# Altium project driver_irf_version.PrjPcb
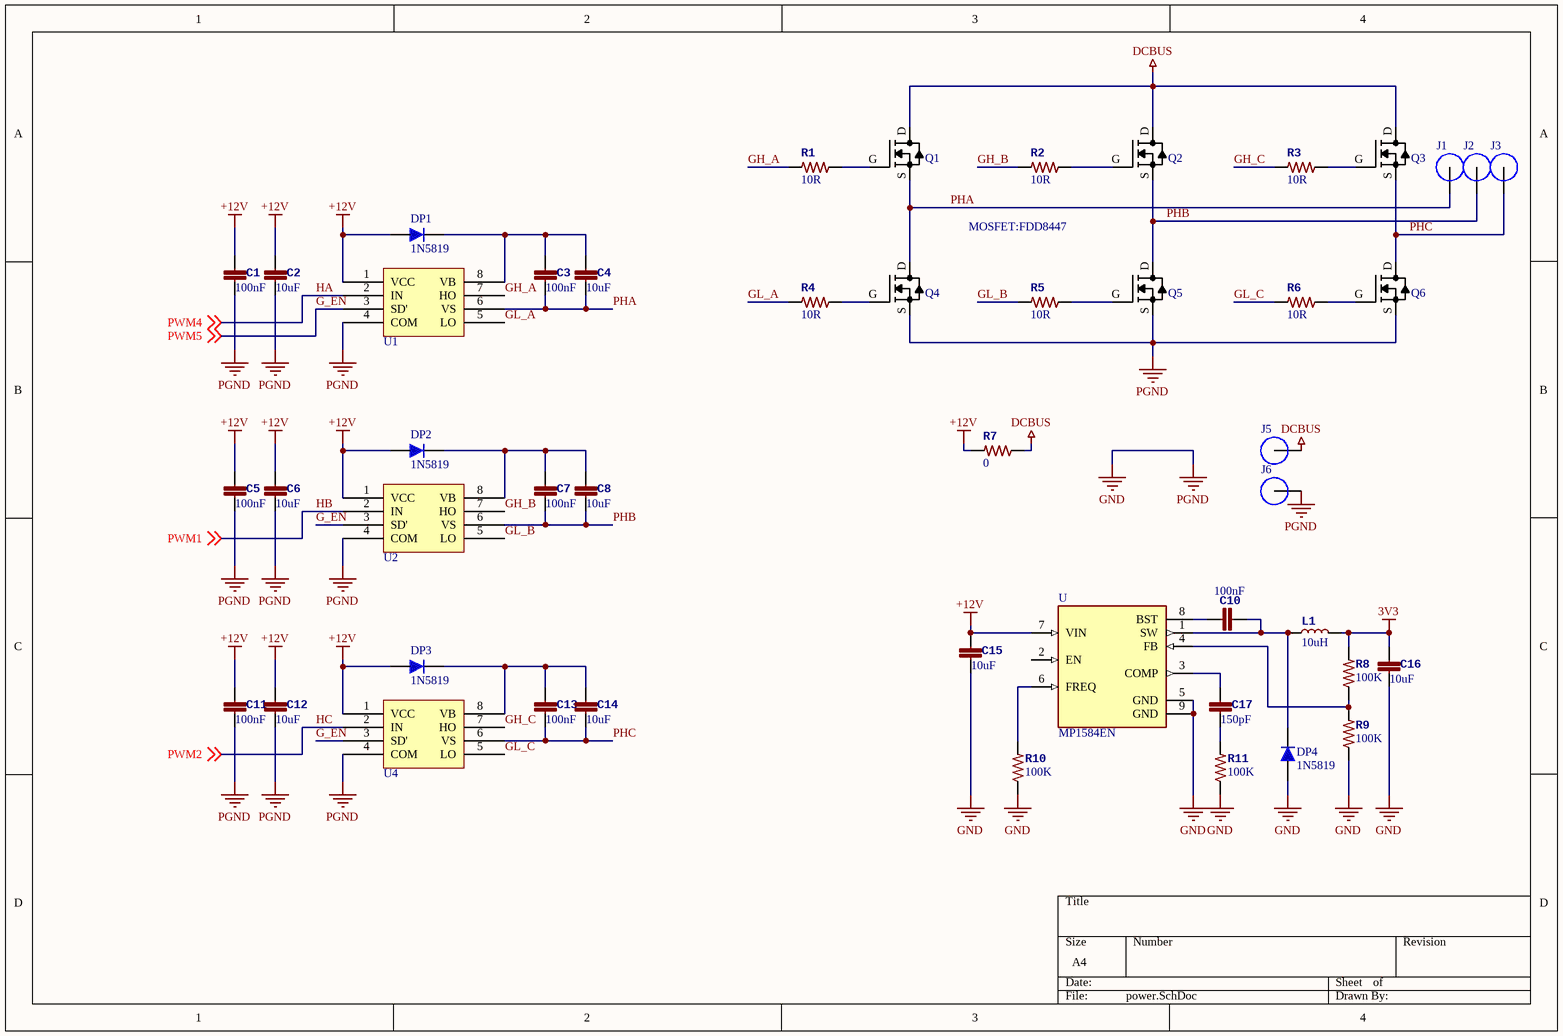
[diagram p0: power.SchDoc]
2 sheets, 67 parts. Net scope: global (net labels, ports and power ports of the same name join across sheets).
Board file: PCB.PcbDoc
Sheets:
  power.SchDoc
  mcu.SchDoc

## Sheet power.SchDoc
size A4

### Parts
C1  value 100nF  [_1206]  (hidden comment: Cap)
C2  value 10uF  [_1206]  (hidden comment: Cap)
C3  value 100nF  [_1206]  (hidden comment: Cap)
C4  value 10uF  [_1206]  (hidden comment: Cap)
C5  value 100nF  [_1206]  (hidden comment: Cap)
C6  value 10uF  [_1206]  (hidden comment: Cap)
C7  value 100nF  [_1206]  (hidden comment: Cap)
C8  value 10uF  [_1206]  (hidden comment: Cap)
C10  value 100nF  [_0805]  (hidden comment: Cap)
C11  value 100nF  [_1206]  (hidden comment: Cap)
C12  value 10uF  [_1206]  (hidden comment: Cap)
C13  value 100nF  [_1206]  (hidden comment: Cap)
C14  value 10uF  [_1206]  (hidden comment: Cap)
C15  value 10uF  [_1206]  (hidden comment: Cap)
C16  value 10uF  [_1206]  (hidden comment: Cap)
C17  value 150pF  [_0805]  (hidden comment: Cap)
DP1  1N5819  [430X270D]
DP2  1N5819  [430X270D]
DP3  1N5819  [430X270D]
DP4  1N5819  [430X270D]
J1  (no value)  [M3 Spade Hole]
J2  (no value)  [M3 Spade Hole]
J3  (no value)  [M3 Spade Hole]
J5  (no value)  [M3 Spade Hole]
J6  (no value)  [M3 Spade Hole]
L1  value 10uH  [_INDUCTOR-SMD-6.0mm]  (hidden comment: Inductor)
Q1  FILL_FOOTPRINT  [TO229P994X240-3N]  (value not drawn)
Q2  FILL_FOOTPRINT  [TO229P994X240-3N]  (value not drawn)
Q3  FILL_FOOTPRINT  [TO229P994X240-3N]  (value not drawn)
Q4  FILL_FOOTPRINT  [TO229P994X240-3N]  (value not drawn)
Q5  FILL_FOOTPRINT  [TO229P994X240-3N]  (value not drawn)
Q6  FILL_FOOTPRINT  [TO229P994X240-3N]  (value not drawn)
R1  value 10R  [_0805]  (hidden comment: Resistor)
R2  value 10R  [_0805]  (hidden comment: Resistor)
R3  value 10R  [_0805]  (hidden comment: Resistor)
R4  value 10R  [_0805]  (hidden comment: Resistor)
R5  value 10R  [_0805]  (hidden comment: Resistor)
R6  value 10R  [_0805]  (hidden comment: Resistor)
R7  value 0  [_1206]  (hidden comment: Resistor)
R8  value 100K  [_0805]  (hidden comment: Resistor)
R9  value 100K  [_0805]  (hidden comment: Resistor)
R10  value 100K  [_0805]  (hidden comment: Resistor)
R11  value 100K  [_0805]  (hidden comment: Resistor)
U  MP1584EN  [SOIC127P600X170-9N]
U1  IR2104  [_SO08]  (value not drawn)
U2  IR2104  [_SO08]  (value not drawn)
U4  IR2104  [_SO08]  (value not drawn)

### Nets
3V3: C16.1 L1.2 R8.2
+12V: C1.1 C2.1 C5.1 C6.1 C11.1 C12.1 C15.1 DP1.1 DP2.1 DP3.1 R7.2 U.7(VIN) U1.1(VCC) U2.1(VCC) U4.1(VCC)
DCBUS: J5.1 Q1.D Q2.D Q3.D R7.1
GND: C1.2 C2.2 C5.2 C6.2 C11.2 C12.2 C15.2 C16.2 DP4.1 J6.1 Q4.S Q5.S Q6.S R9.1 R10.1 R11.1 U.5(GND) U.9(GND) U1.4(COM) U2.4(COM) U4.4(COM)  [also labelled PGND]
G_EN: U1.3(SD') U2.3(SD') U4.3(SD') ; off-sheet PWM5  [also labelled PWM5]
GH_A: R1.2 U1.7(HO)
GH_B: R2.2 U2.7(HO)
GH_C: R3.2 U4.7(HO)
GL_A: R4.2 U1.5(LO)
GL_B: R5.2 U2.5(LO)
GL_C: R6.2 U4.5(LO)
HA: U1.2(IN) ; off-sheet PWM4  [also labelled PWM4]
HB: U2.2(IN) ; off-sheet PWM1  [also labelled PWM1]
HC: U4.2(IN) ; off-sheet PWM2  [also labelled PWM2]
PHA: C3.2 C4.2 J1.1 Q1.S Q4.D U1.6(VS)
PHB: C7.2 C8.2 J2.1 Q2.S Q5.D U2.6(VS)
PHC: C13.2 C14.2 J3.1 Q3.S Q6.D U4.6(VS)
NetC3_1: C3.1 C4.1 DP1.2 U1.8(VB)
NetC7_1: C7.1 C8.1 DP2.2 U2.8(VB)
NetC10_1: C10.1 U.8(BST)
NetC10_2: C10.2 DP4.2 L1.1 U.1(SW)
NetC13_1: C13.1 C14.1 DP3.2 U4.8(VB)
NetC17_1: C17.1 U.3(COMP)
NetC17_2: C17.2 R11.2
NetQ1_G: Q1.G R1.1
NetQ2_G: Q2.G R2.1
NetQ3_G: Q3.G R3.1
NetQ4_G: Q4.G R4.1
NetQ5_G: Q5.G R5.1
NetQ6_G: Q6.G R6.1
NetR8_1: R8.1 R9.2 U.4(FB)
NetR10_2: R10.2 U.6(FREQ)

Not connected (* = marked no-connect by the designer): U 2(EN)

### Notes on the sheet
- MOSFET:FDD8447

### Library data of the parts
C1-C8 C10-C17 = Cap_1
DP1-DP4 = 1N5819: Schottkey Rectifiers; Designer: Abbas Basereh; Data: 16-12-2016; Link: *; Part. No: *
J1-J3 J5 J6 = M3 Spade Terminal
Q1-Q6 = NTMFS4935NT1G: MOSFET N-CH 30V 13A SO8FL; Manufacturer: ON Semiconductor; FET Type: N-Channel; Current - Continuous Drain (Id) @ 25°C: 13A (Ta), 93A (Tc); Drive Voltage (Max Rds On,  Min Rds On): 4.5V, 10V; Vgs(th) (Max) @ Id: 2.2V @ 250µA; Gate Charge (Qg) (Max) @ Vgs: 49.4nC @ 10V; Input Capacitance (Ciss) (Max) @ Vds: 4850pF @ 15V; Vgs (Max): ±20V; Power Dissipation (Max): 930mW (Ta), 48W (Tc); Rds On (Max) @ Id, Vgs: 3.2 mOhm @ 30A, 10V; Supplier 1: Digi-Key; Supplier Part Number 1: NTMFS4935NT1GOSCT-ND; RoHS: RoHS Compliant; Category: Discrete Semiconductor Products; Stock 1: 932; Pricing 1: 1=0.61, 10=0.541, 100=0.4145, 500=0.3277 (USD); Packaging: Cut Tape (CT); Part Status: Active; Technology: MOSFET (Metal Oxide); Drain to Source Voltage (Vdss): 30V; FET Feature: -; Operating Temperature: -55°C ~ 150°C (TJ); Mounting Type: Surface Mount; Supplier Device Package: 5-DFN (5x6) (8-SOFL); Package / Case: 8-PowerTDFN, 5 Leads; ComponentLink1URL: http://www.onsemi.com/pub_link/Collateral/NTMFS4935N-D.PDF; ComponentLink1Description: http://www.onsemi.com/pub_link/Collateral/NTMFS4935N-D.PDF; Manufacturer Part Number: NTMFS4935NT1G
U = MP1584EN: Buck Switching Regulator IC Positive Adjustable 0.8V 1 Output 3A 8-SOIC _0.154, 3.90mm Width_ Exposed Pad; MF: Monolithic Power; MP: MP1584EN; Value: *; Package: SOIC-8 Monolithic Power; SnapEDA_Link: https://www.snapeda.com/parts/MP1584EN/Monolithic%20Power%20Systems%20Inc./view-part/891721/?ref=snap; Price: None; Availability: Unavailable

## Sheet mcu.SchDoc
size A4
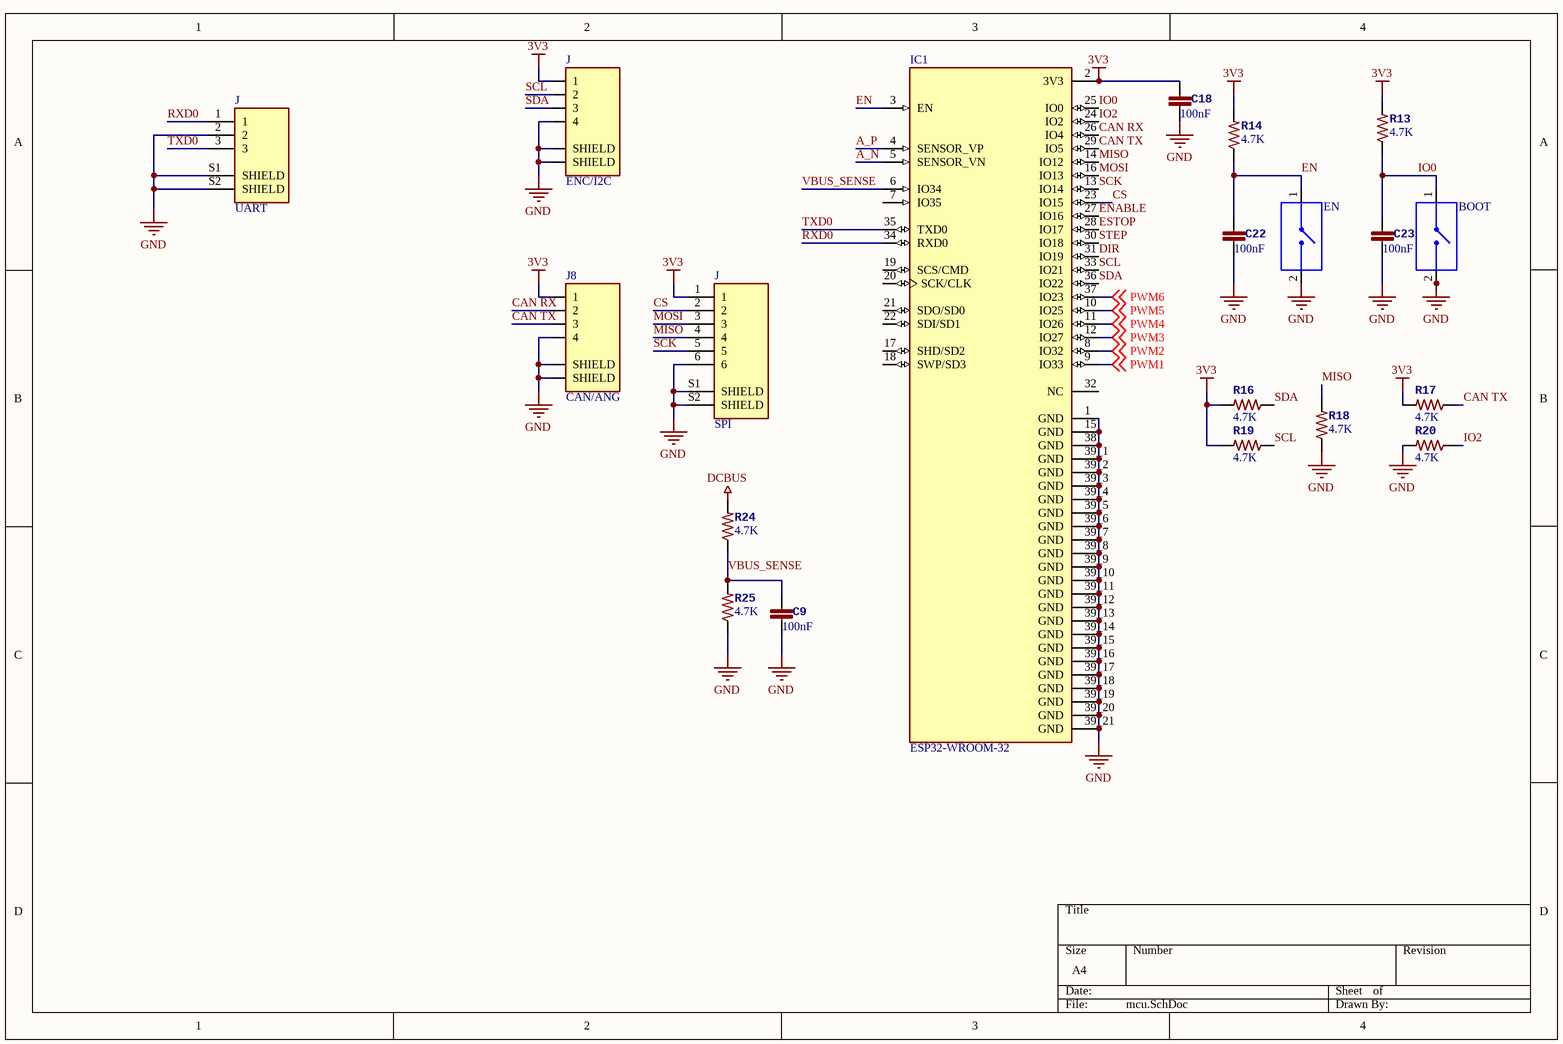
[diagram p1: mcu.SchDoc]

### Parts
(Parts that share a designator on the sheet are numbered #1, #2 ... from top to bottom, then left to right.)
BOOT  1437566-4  [SW_1437566-4]  (value not drawn)
C9  value 100nF  [_0805]  (hidden comment: Cap)
C18  value 100nF  [_0805]  (hidden comment: Cap)
C22  value 100nF  [_0805]  (hidden comment: Cap)
C23  value 100nF  [_0805]  (hidden comment: Cap)
EN  1437566-4  [SW_1437566-4]  (value not drawn)
IC1  ESP32-WROOM-32  [MODULE_ESP32-WROOM-32]
J8  CAN/ANG  [JST_SM04B-SRSS-TB(LF)(SN)]
J#1  ENC/I2C  [JST_SM04B-SRSS-TB(LF)(SN)]
J#2  UART  [JST_SM03B-SRSS-TB(LF)(SN)]
J#3  SPI  [JST_SM06B-SRSS-TB(LF)(SN)]
R13  value 4.7K  [_0805]  (hidden comment: Resistor)
R14  value 4.7K  [_0805]  (hidden comment: Resistor)
R16  value 4.7K  [_0805]  (hidden comment: Resistor)
R17  value 4.7K  [_0805]  (hidden comment: Resistor)
R18  value 4.7K  [_0805]  (hidden comment: Resistor)
R19  value 4.7K  [_0805]  (hidden comment: Resistor)
R20  value 4.7K  [_0805]  (hidden comment: Resistor)
R24  value 4.7K  [_0805]  (hidden comment: Resistor)
R25  value 4.7K  [_0805]  (hidden comment: Resistor)

### Nets
3V3: C18.1 IC1.2(3V3) J8.1 J#1.1 J#3.1 R13.2 R14.2 R16.2 R17.2 R19.2
DCBUS: R24.2
GND: BOOT.2 C9.2 C18.2 C22.2 C23.2 EN.2 IC1.1(GND) IC1.15(GND) IC1.38(GND) IC1.39_1(GND) IC1.39_2(GND) IC1.39_3(GND) IC1.39_4(GND) IC1.39_5(GND) IC1.39_6(GND) IC1.39_7(GND) IC1.39_8(GND) IC1.39_9(GND) IC1.39_10(GND) IC1.39_11(GND) IC1.39_12(GND) IC1.39_13(GND) IC1.39_14(GND) IC1.39_15(GND) IC1.39_16(GND) IC1.39_17(GND) IC1.39_18(GND) IC1.39_19(GND) IC1.39_20(GND) IC1.39_21(GND) J8.4 J8.S1(SHIELD) J8.S2(SHIELD) J#1.4 J#1.S1(SHIELD) J#1.S2(SHIELD) J#2.2 J#2.S1(SHIELD) J#2.S2(SHIELD) J#3.6 J#3.S1(SHIELD) J#3.S2(SHIELD) R18.1 R20.2 R25.1
A_N: IC1.5(SENSOR_VN)
A_P: IC1.4(SENSOR_VP)
CAN RX: IC1.26(IO4) J8.2
CAN TX: IC1.29(IO5) J8.3 R17.1
CS: IC1.23(IO15) J#3.2
DIR: IC1.31(IO19)
EN: C22.1 EN.1 IC1.3(EN) R14.1
ENABLE: IC1.27(IO16)
ESTOP: IC1.28(IO17)
IO0: BOOT.1 C23.1 IC1.25(IO0) R13.1
IO2: IC1.24(IO2) R20.1
MISO: IC1.14(IO12) J#3.4 R18.2
MOSI: IC1.16(IO13) J#3.3
PWM1: IC1.9(IO33) ; off-sheet PWM1  [project net HB]
PWM2: IC1.8(IO32) ; off-sheet PWM2  [project net HC]
PWM3: IC1.12(IO27) ; off-sheet PWM3
PWM4: IC1.11(IO26) ; off-sheet PWM4  [project net HA]
PWM5: IC1.10(IO25) ; off-sheet PWM5  [project net G_EN]
PWM6: IC1.37(IO23) ; off-sheet PWM6
RXD0: IC1.34(RXD0) J#2.1
SCK: IC1.13(IO14) J#3.5
SCL: IC1.33(IO21) J#1.2 R19.1
SDA: IC1.36(IO22) J#1.3 R16.1
STEP: IC1.30(IO18)
TXD0: IC1.35(TXD0) J#2.3
VBUS_SENSE: C9.1 IC1.6(IO34) R24.1 R25.2

Not connected (* = marked no-connect by the designer): IC1 7(IO35) 17(SHD/SD2) 18(SWP/SD3) 19(SCS/CMD) 20(SCK/CLK) 21(SDO/SD0) 22(SDI/SD1) 32(NC)

### Library data of the parts
BOOT EN = 1437566-4: Switch Tactile OFF _ON_ SPST Rectangular Button Gull Wing 0.05A 12VDC 1.77N SMD T/R; MF: TE Connectivity; Configuration_Pole-Throw: Single Pole - Single Throw; Contact_Current_Rating: 50 mA; MP: FSMSMTR; Package: None; Digi-Key_Part_Number: 450-1758-1-ND; Digi-Key_Purchase_URL: https://www.digikey.com/product-detail/en/te-connectivity-alcoswitch-switches/FSMSMTR/450-1758-1-ND/2271637?utm_source=snapeda&utm_medium=aggregator&utm_campaign=symbol; Value: *; TE_purchase_URL: https://www.te.com/usa-en/product-1437566-4.html?te_bu=Cor&te_type=disp&te_campaign=seda_glo_cor-seda-global-disp-prtnr-fy19-seda-model-bom-cta_sma-317_1&elqCampaignId=32493; SnapEDA_Link: https://www.snapeda.com/parts/FSMSMTR/TE%20Connectivity%20ALCOSWITCH%20Switches/view-part/2118497/?ref=snap
C9 C18 C22 C23 = Cap_1
IC1 = ESP32-WROOM-32: Bluetooth, WiFi 802.11b/g/n, Bluetooth v4.2 +EDR, Class 1, 2 and 3 Transceiver Module 2.4GHz ~ 2.5GHz Antenna Not Included, U.FL Surface Mount; MF: Espressif Systems; MP: ESP32-WROOM-32; Purchase-URL: https://pricing.snapeda.com/search/part/ESP32-WROOM-32/?ref=eda; Package: Module Espressif Systems; Value: *; Digi-Key_Part_Number: 1965-ESP32-WROOM-32U-N4CT-ND; Check_prices: https://www.snapeda.com/parts/ESP32-WROOM-32/Espressif+Systems/view-part/?ref=eda; SnapEDA_Link: https://www.snapeda.com/parts/ESP32-WROOM-32/Espressif+Systems/view-part/?ref=snap
J8 J#1 = SM04B-SRSS-TB(LF)(SN): Connector Header Surface Mount, Right Angle 4 position 0.039 _1.00mm_; MF: JST Sales; MP: SM04B-SRSS-TB_LF__SN_; Price: None; SnapEDA_Link: https://www.snapeda.com/parts/SM04B-SRSS-TB%28LF%29%28SN%29/JST%20Sales%20America%20Inc./view-part/557466/?ref=snap; Value: *; Availability: Unavailable; Package: None
J#2 = SM03B-SRSS-TB(LF)(SN): Connector Header Surface Mount, Right Angle 3 position 0.039 _1.00mm_; MP: SM03B-SRSS-TB_LF__SN_; MF: JST Sales; SnapEDA_Link: https://www.snapeda.com/parts/SM03B-SRSS-TB%28LF%29%28SN%29/JST%20Sales%20America%20Inc./view-part/3227115/?ref=snap; Availability: Unavailable; Price: None; Value: *; Package: None
J#3 = SM06B-SRSS-TB(LF)(SN): Connector Header Surface Mount, Right Angle 6 position 0.039 _1.00mm_; MP: SM06B-SRSS-TB_LF__SN_; MF: JST Sales; Package: None; Value: *; SnapEDA_Link: https://www.snapeda.com/parts/SM06B-SRSS-TB%28LF%29%28SN%29/JST%20Sales%20America%20Inc./view-part/554386/?ref=snap; Digi-Key_Purchase_URL: https://www.digikey.com/product-detail/en/jst-sales-america-inc/SM06B-SRSS-TB_LF__SN_/455-1806-1-ND/926877?utm_source=snapeda&utm_medium=aggregator&utm_campaign=symbol; Digi-Key_Part_Number: 455-1806-1-ND

## Nets that join several sheets
3V3: power (C16.1 L1.2 R8.2), mcu (10 pins)
DCBUS: power (5 pins), mcu (R24.2)
GND: power (21 pins), mcu (45 pins)
G_EN: power (U1.3 U2.3 U4.3), mcu (IC1.10)
HA: power (U1.2), mcu (IC1.11)
HB: power (U2.2), mcu (IC1.9)
HC: power (U4.2), mcu (IC1.8)